# EAGLE design LPC218devboard (EAGLE 7.7.0)
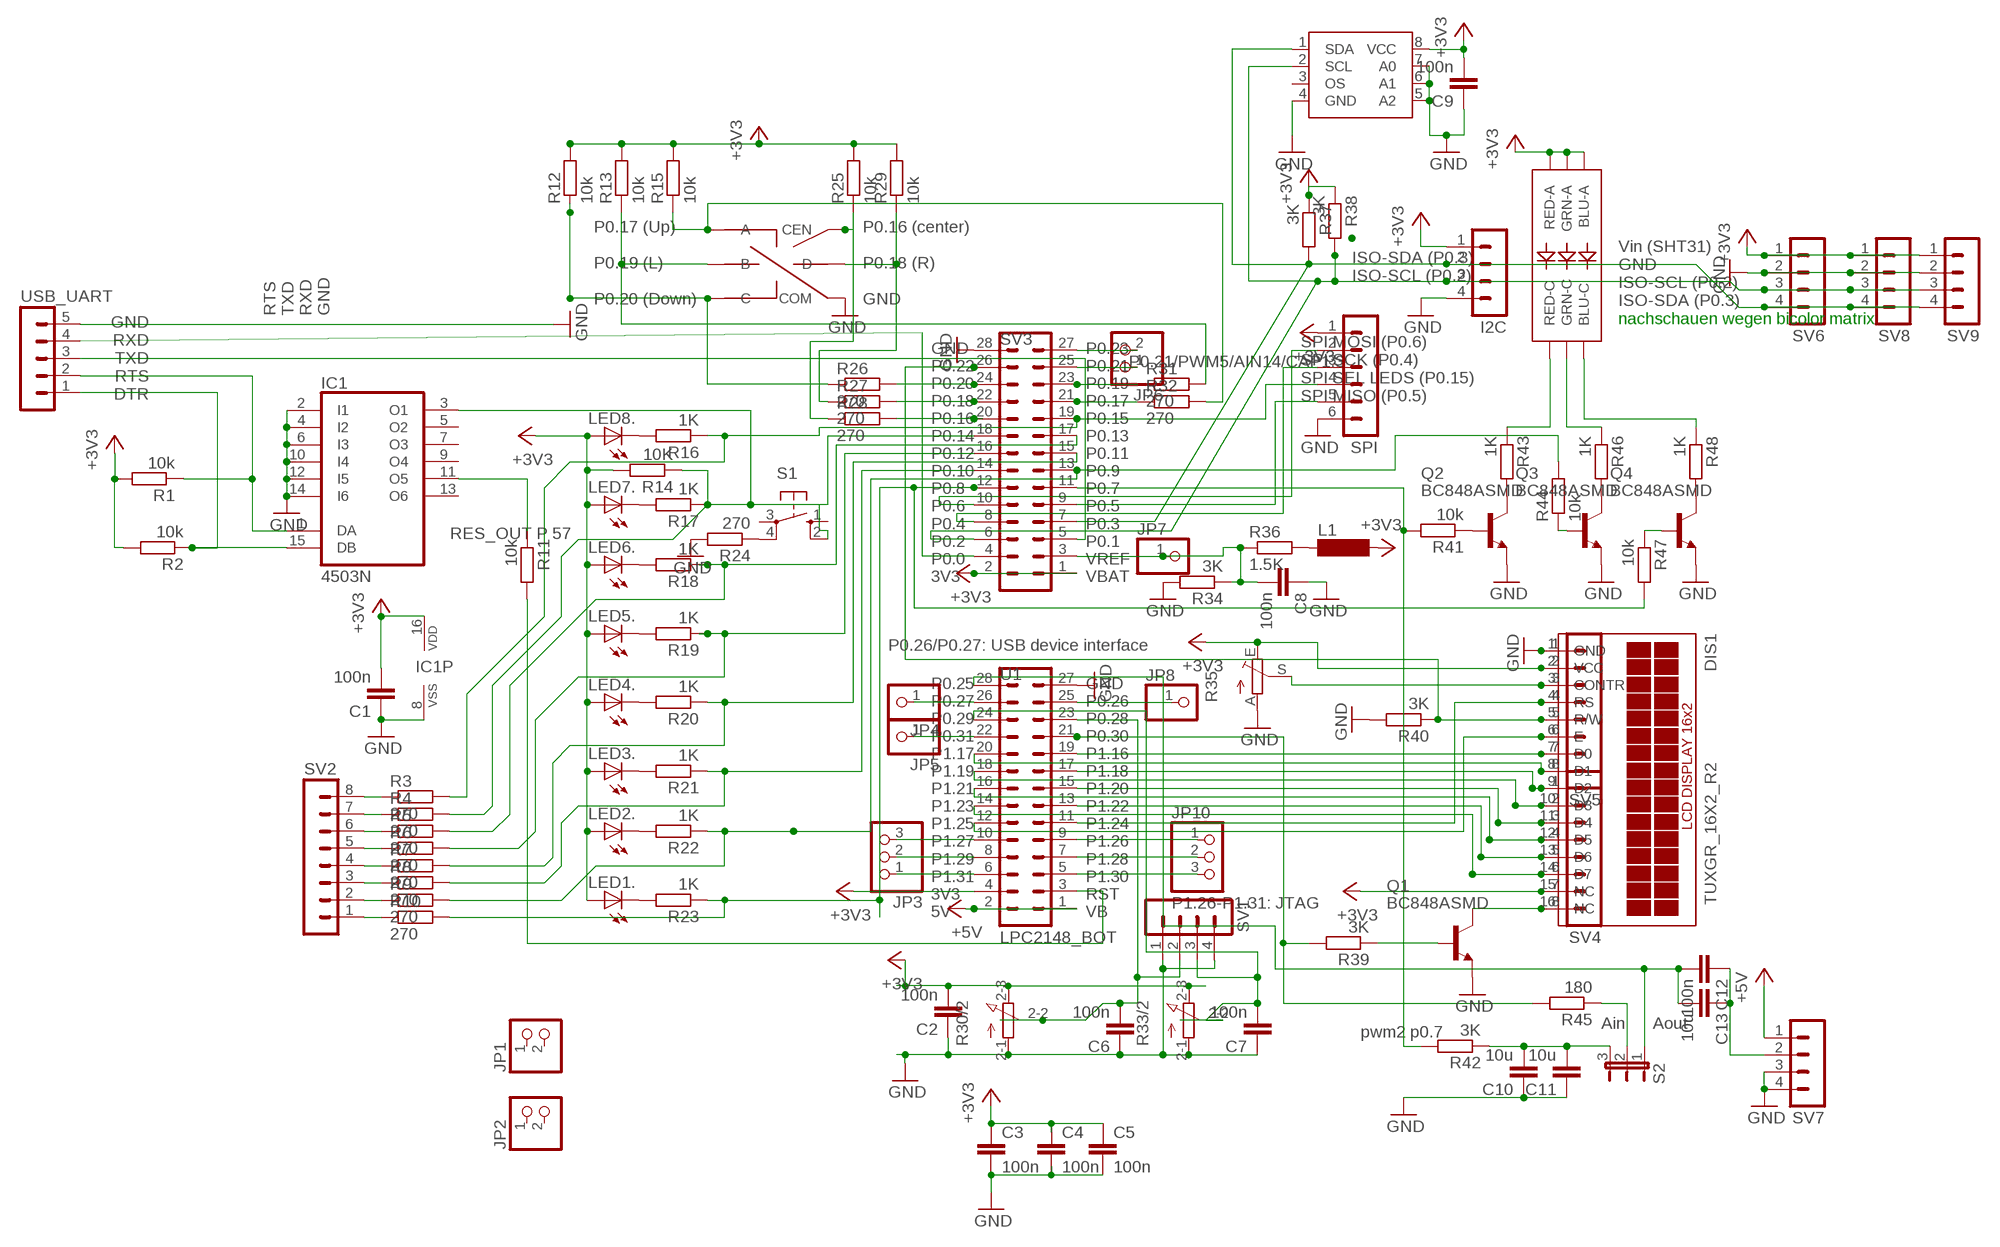
[diagram p0: schematic, sheet 1]

## Parts
C1  100n  C-EUC0805  [C0805]
C2  100n  C-EUC0805  [C0805]
C3  100n  C-EUC0805  [C0805]
C4  100n  C-EUC0805  [C0805]
C5  100n  C-EUC0805  [C0805]
C6  100n  C-EUC0805  [C0805]
C7  100n  C-EUC0805  [C0805]
C8  100n  C-EUC0805  [C0805]
C9  100n  C-EUC0805  [C0805]
C10  10u  C-EUC1206K  [C1206K]
C11  10u  C-EUC1206K  [C1206K]
C12  100n  C-EUC0805  [C0805]
C13  10u  C-EUC1206K  [C1206K]
D1  LED-RGBNO_IC  [LED-TRICOLOR-5050]
DIS1  TUXGR_16X2_R2  [TUXGR_16X2_R2]
I2C  MA04-1  [MA04-1]
IC1  4503N  [DIL16]
IC2  LM75A  [SO8]
JP1  PINHD-1X2  [1X02]
JP2  PINHD-1X2  [1X02]
JP3  PINHD-1X3  [1X03]
JP4  PINHD-1X1  [1X01]
JP5  PINHD-1X1  [1X01]
JP6  PINHD-1X2  [1X02]
JP7  PINHD-1X1  [1X01]
JP8  PINHD-1X1  [1X01]
JP10  PINHD-1X3  [1X03]
L1  MS50  [MS50]
LED1.  LED5MM  [LED5MM]
LED2.  LED5MM  [LED5MM]
LED3.  LED5MM  [LED5MM]
LED4.  LED5MM  [LED5MM]
LED5.  LED5MM  [LED5MM]
LED6.  LED5MM  [LED5MM]
LED7.  LED5MM  [LED5MM]
LED8.  LED5MM  [LED5MM]
Q1  BC848ASMD  [SOT23]
Q2  BC848ASMD  [SOT23]
Q3  BC848ASMD  [SOT23]
Q4  BC848ASMD  [SOT23]
R1  10k  R-EU_0207/12  [0207/12]
R2  10k  R-EU_0207/12  [0207/12]
R3  270  R-EU_R0805  [R0805]
R4  270  R-EU_R0805  [R0805]
R5  270  R-EU_R0805  [R0805]
R6  270  R-EU_R0805  [R0805]
R7  270  R-EU_R0805  [R0805]
R8  270  R-EU_R0805  [R0805]
R9  270  R-EU_R0805  [R0805]
R10  270  R-EU_R0805  [R0805]
R11  10k  R-EU_0207/12  [0207/12]
R12  10k  R-EU_0207/12  [0207/12]
R13  10k  R-EU_0207/12  [0207/12]
R14  10K  R-EU_0207/12  [0207/12]
R15  10k  R-EU_0207/12  [0207/12]
R16  1K  R-EU_0204/7  [0204/7]
R17  1K  R-EU_0204/7  [0204/7]
R18  1K  R-EU_0207/10  [0207/10]
R19  1K  R-EU_0207/12  [0207/12]
R20  1K  R-EU_0207/10  [0207/10]
R21  1K  R-EU_0207/12  [0207/12]
R22  1K  R-EU_0207/12  [0207/12]
R23  1K  R-EU_0207/15  [0207/15]
R24  270  R-EU_0207/12  [0207/12]
R25  10k  R-EU_0207/12  [0207/12]
R26  270  R-EU_0207/12  [0207/12]
R27  270  R-EU_0207/12  [0207/12]
R28  270  R-EU_0207/12  [0207/12]
R29  10k  R-EU_0207/12  [0207/12]
R30  DUAL_15MM_SHAFT  [RK097G]
R31  270  R-EU_0207/12  [0207/12]
R32  270  R-EU_0207/12  [0207/12]
R33  DUAL_15MM_SHAFT  [RK097G]
R34  3K  R-EU_0207/12  [0207/12]
R35  TRIM_EU-S63P  [S63P]
R36  1.5K  R-EU_0207/10  [0207/10]
R37  3K  R-EU_R0805  [R0805]
R38  3K  R-EU_R0805  [R0805]
R39  3K  R-EU_R0805  [R0805]
R40  3K  R-EU_R0805  [R0805]
R41  10k  R-EU_0207/12  [0207/12]
R42  3K  R-EU_0207/12  [0207/12]
R43  1K  R-EU_R0805  [R0805]
R44  10k  R-EU_0207/12  [0207/12]
R45  180  R-EU_0817/22  [P0817/22]
R46  1K  R-EU_R0805  [R0805]
R47  10k  R-EU_0207/12  [0207/12]
R48  1K  R-EU_R0805  [R0805]
S1  40-XX  [B3F-40XX]
S2  JP2E_ORIGJP2_ORIG  [JP2_ORIG]
SPI  MA06-1  [MA06-1]
SV1  MA04-1  [MA04-1]
SV2  MA08-1  [MA08-1]
SV3  LPC2148_TOP  [ML26]
SV4  MA08-1  [MA08-1]
SV5  MA08-1  [MA08-1]
SV6  MA04-1  [MA04-1]
SV7  MA04-1  [MA04-1]
SV8  MA04-1  [MA04-1]
SV9  MA04-1  [MA04-1]
SW1  ALPS_SKQ_MDSPTH  [ALPS_SKQ_MDS_PTH]
U1  LPC2148_BOT  [ML26]
USB_UART  MA05-1  [MA05-1]

## Nets
+3V3: C1.2 C2.2 C3.1 C4.1 C5.1 C9.2 D1.1(GRN-A) D1.2(RED-A) D1.3(BLU-A) DIS1.2(VCC) DIS1.15(NC) I2C.1 IC1.16(VDD) IC2.8(VCC) L1.2 LED1..A LED2..A LED3..A LED4..A LED5..A LED6..A LED7..A LED8..A R1.2 R2.2 R12.2 R13.2 R14.2 R15.2 R25.2 R29.2 R30.2-3(/2:E) R33.2-3(/2:E) R35.E R37.1 R38.1 SPI.1 SV3.1 SV3.2 SV4.7 SV5.2 SV6.1 SV8.1 SV9.1 U1.4
+5V: SV7.1 U1.1 U1.2
GND: C1.1 C2.1 C3.2 C4.2 C5.2 C6.1 C7.1 C8.1 C9.1 C10.1 C11.1 DIS1.1(GND) I2C.4 IC1.2(I1) IC1.4(I2) IC1.6(I3) IC1.8(VSS) IC1.10(I4) IC1.12(I5) IC1.14(I6) IC2.4(GND) IC2.5(A2) IC2.6(A1) IC2.7(A0) Q1.2(E) Q2.2(E) Q3.2(E) Q4.2(E) R24.2 R30.2-1(/2:A) R33.2-1(/2:A) R34.2 R35.A R40.2 SPI.6 SV1.1 SV1.4 SV3.28 SV5.1 SV6.2 SV7.3 SV7.4 SV8.2 SV9.2 SW1.4(COM) U1.27 USB_UART.5
N$1: IC1.1(DA) R1.1 USB_UART.2
N$2: DIS1.7(D0) SV5.7 U1.19
N$3: DIS1.8(D1) SV5.8 U1.20
N$4: DIS1.9(D2) SV4.1 U1.17
N$5: DIS1.10(D3) SV4.2 U1.18
N$6: DIS1.11(D4) SV4.3 U1.15
N$7: DIS1.12(D5) SV4.4 U1.16
N$8: DIS1.13(D6) SV4.5 U1.13
N$10: R11.2 U1.3
N$12: DIS1.5(R/W) R40.1 SV3.26 SV5.5
N$13: DIS1.6(E) SV5.6 U1.12
N$14: R39.2 R45.2 U1.21
N$15: Q1.1(B) R39.1
N$16: DIS1.16(NC) Q1.3(C) SV4.8
N$17: DIS1.3(CONTR) R35.S SV5.3
N$18: R26.2 SV3.24
N$19: R27.2 SV3.22
N$20: R28.2 SV3.20
N$21: R32.1 SV3.21
N$22: R31.1 SV3.23
N$23: R25.1 R28.1 SW1.6(CEN)
N$24: R27.1 R29.1 SW1.5(D)
N$25: R15.1 R32.2 SW1.1(A)
N$26: R13.1 R31.2 SW1.2(B)
N$27: R12.1 R26.1 SW1.3(C)
N$28: LED1..K(C) R23.2
N$29: LED2..K(C) R22.2
N$30: R24.1 S1.4(P1)
N$31: LED7..K(C) R17.2
N$32: R3.1 SV2.8
N$33: R4.1 SV2.7
N$34: Q4.3(C) R48.2
N$35: LED3..K(C) R21.2
N$36: LED4..K(C) R20.2
N$37: R5.1 SV2.6
N$38: R6.1 SV2.5
N$39: R7.1 SV2.4
N$41: Q3.3(C) R46.2
N$42: LED5..K(C) R19.2
N$43: LED6..K(C) R18.2
N$44: R8.1 SV2.3
N$45: R9.1 SV2.2
N$46: R10.1 SV2.1
N$48: Q2.3(C) R43.2
N$50: LED8..K(C) R16.2
N$52: L1.1 R36.2
N$55: Q2.1(B) R41.1
N$56: D1.5(RED-C) R43.1
N$57: D1.6(GRN-C) R46.1
N$58: D1.4(BLU-C) R48.1
N$59: R41.2 R42.2 SV3.11
N$60: Q4.1(B) R47.1
N$61: Q3.1(B) R44.1
N$62: SV3.4 USB_UART.4
N$63: SV3.5 USB_UART.3
N$66: C6.2 R30.2-2(/2:S) SV1.2 U1.23
N$67: R45.1 S2.2
N$68: C7.2 R33.2-2(/2:S) SV1.3 U1.24
N$69: C12.1 C13.1 SV7.2
N$70: C10.2 C11.2 R42.1 S2.3
N$71: IC1.11(O5) R11.1
N$72: C12.2 C13.2 S2.1 U1.28
N$73: IC1.15(DB) R2.1 USB_UART.1
N$74: C8.2 JP7.1 R34.1 R36.1 SV3.3
N$75: JP10.1 U1.9
N$76: JP10.2 U1.7
N$77: JP10.3 U1.5
N$78: JP3.3 U1.10
N$79: JP3.2 U1.8
N$80: JP3.1 U1.6
N$81: JP4.1 U1.26
N$82: JP5.1 U1.22
N$83: JP8.1 U1.25
P0.8: R10.2 R23.1 R47.2 SV3.12
P0.9: R9.2 R22.1 R44.2 SV3.13
P0.10: R8.2 R21.1 SV3.14
P0.11: R7.2 R20.1 SV3.15
P0.12: R6.2 R19.1 SV3.16
P0.13: R5.2 R18.1 SV3.17
P0.14: IC1.3(O1) R4.2 R14.1 R17.1 S1.2(S1) SV3.18
P0.21: JP6.1 SV3.25
P0.23: JP6.2 SV3.27
P1.23: DIS1.14(D7) SV4.6 U1.14
P1.24: DIS1.4(RS) SV5.4 U1.11
SCL: I2C.3 IC2.2(SCL) R38.2 SV3.6 SV6.3 SV8.3 SV9.3
SDA: I2C.2 IC2.1(SDA) R37.2 SV3.7 SV6.4 SV8.4 SV9.4
SPI_MISO: SPI.5 SV3.9
SPI_MOSI: SPI.2 SV3.10
SPI_SCK: SPI.3 SV3.8
SPI_SEL: R3.2 R16.1 SPI.4 SV3.19
Unconnected: IC1.5(O2) IC1.7(O3) IC1.9(O4) IC1.13(O6) IC2.3(OS) JP1.1 JP1.2 JP2.1 JP2.2 R30.1-1(/1:A) R30.1-2(/1:S) R30.1-3(/1:E) R33.1-1(/1:A) R33.1-2(/1:S) R33.1-3(/1:E) S1.1(S) S1.3(P)

## Notes on the sheet
- ISO-SDA (P0.3)
  ISO-SCL (P0.2)
- GND
  RXD
  TXD
  RTS
  DTR
- RTS
  TXD
  RXD
  GND
- Vin (SHT31)
  GND
  ISO-SCL (P0.2)
  ISO-SDA (P0.3)
- nachschauen wegen bicolor matrix
- P0.21/PWM5/AIN14/CAP1.3
- SPI MOSI (P0.6)
  SPI SCK (P0.4)
  SPI SEL LEDS (P0.15)
  SPI MISO (P0.5)
- RES_OUT P 57
- P0.26/P0.27: USB device interface
- P1.26-P1.31: JTAG
- Ain | Aout
- pwm2 p0.7

## Library data of the parts
C1-C13 = rcl:C-EU: CAPACITOR, European symbol
D1 = LED-RGB:LED-RGB; PROD_ID: DIO-10298
DIS1 = display-lcd:TUXGR_16X2_R2: Tuxgraphics LCD display 16x2 characters reflective, without background light Source: tuxgr_12x2_r2.pdf; OC_FARNELL: unknown; OC_NEWARK: unknown
I2C SV1 SV6-SV9 = con-lstb:MA04-1: PIN HEADER; OC_FARNELL: unknown; OC_NEWARK: unknown
IC1 = 45xx:4503: Tri-state hex BUFFER, 74C367, 80C97
IC2 = LM75A:LM75A
JP1 JP2 JP6 = pinhead:PINHD-1X2: PIN HEADER
JP3 JP10 = pinhead:PINHD-1X3: PIN HEADER
JP4 JP5 JP7 JP8 = pinhead:PINHD-1X1: PIN HEADER
L1 = inductor-neosid:MS50: INDUCTOR SMD power inductor; OC_FARNELL: unknown; OC_NEWARK: unknown
LED1. LED2. LED3. LED4. LED5. LED6. LED7. LED8. = led:LED: LED OSRAM: - CHIPLED LG R971, LG N971, LY N971, LG Q971, LY Q971, LO R971, LY R971 LH N974, LH R974 LS Q976, LO Q976, LY Q976 LO Q996 - Hyper CHIPLED LW Q18S LB Q993, LB Q99A, LB R99A - SideLED LS A670, LO A670, LY A670, LG A670, LP A670 LB A673, LV A673, LT A673, LW A673 LH A674 LY A675 LS A676, LA A676, LO A676, LY A676, LW A676 LS A679, LY A679, LG A679 - Hyper Micro SIDELED® LS Y876, LA Y876, LO Y876, LY Y876 LT Y87S - SmartLED LW L88C, LW L88S LB L89C, LB L89S, LG L890 LS L89K, LO L89K, LY L89K LS L896, LA L896, LO L896, LY L896 - TOPLED LS T670, LO T670, LY T670, LG T670, LP T670 LSG T670, LSP T670, LSY T670, LOP T670, LYG T670 LG T671, LOG T671, LSG T671 LB T673, LV T673, LT T673, LW T673 LH T674 LS T676, LA T676, LO T676, LY T676, LB T676, LH T676, LSB T676, LW T676 LB T67C, LV T67C, LT T67C, LS T67K, LO T67K, LY T67K, LW E67C LS E67B, LA E67B, LO E67B, LY E67B, LB E67C, LV E67C, LT E67C LW T67C LS T679, LY T679, LG T679 LS T770, LO T770, LY T770, LG T770, LP T770 LB T773, LV T773, LT T773, LW T773 LH T774 LS E675, LA E675, LY E675, LS T675 LS T776, LA T776, LO T776, LY T776, LB T776 LHGB T686 LT T68C, LB T68C - Hyper Mini TOPLED® LB M676 - Mini TOPLED Santana® LG M470 LS M47K, LO M47K, LY M47K Source: http://www.osram.convergy.de LUXEON: - LUMILED® LXK2-PW12-R00, LXK2-PW12-S00, LXK2-PW14-U00, LXK2-PW14-V00 LXK2-PM12-R00, LXK2-PM12-S00, LXK2-PM14-U00 LXK2-PE12-Q00, LXK2-PE12-R00, LXK2-PE12-S00, LXK2-PE14-T00, LXK2-PE14-U00 LXK2-PB12-K00, LXK2-PB12-L00, LXK2-PB12-M00, LXK2-PB14-N00, LXK2-PB14-P00, LXK2-PB14-Q00 LXK2-PR12-L00, LXK2-PR12-M00, LXK2-PR14-Q00, LXK2-PR14-R00 LXK2-PD12-Q00, LXK2-PD12-R00, LXK2-PD12-S00 LXK2-PH12-R00, LXK2-PH12-S00 LXK2-PL12-P00, LXK2-PL12-Q00, LXK2-PL12-R00 Source: www.luxeon.com KINGBRIGHT: KA-3528ASYC Source: www.kingbright.com
Q1-Q4 = transistor-npn:BC848*: NPN Transistor
R1-R29 R31 R32 R34 R36-R48 = rcl:R-EU_: RESISTOR, European symbol
R30 R33 = poti_RK097G:DUAL_15MM_SHAFT: 16mm Potentiometer two level Source: http://www.alphapotentiometers.net/html/16mm_pot_2.html
R35 = pot:TRIM_EU-: POTENTIOMETER
S1 = switch-omron:40-XX: OMRON SWITCH; MF: OMRON COMPONENTS USA; MPN: B3F-4000; OC_FARNELL: 176434; OC_NEWARK: 36K3105
S2 = Switch Aliexpress 2:JP2E_ORIG
SPI = con-lstb:MA06-1: PIN HEADER; OC_FARNELL: unknown; OC_NEWARK: unknown
SV2 SV4 SV5 = con-lstb:MA08-1: PIN HEADER; OC_FARNELL: unknown; OC_NEWARK: unknown
SV3 = con_LPC2148:LPC2148_TOP: LPC2148 dev board
SW1 = ALPS_SKQ_MDS:ALPS_SKQ_MDS
U1 = con_LPC2148:LPC2148_BOT: LPC2148 dev board
USB_UART = con-lstb:MA05-1: PIN HEADER; OC_FARNELL: unknown; OC_NEWARK: unknown

## Board
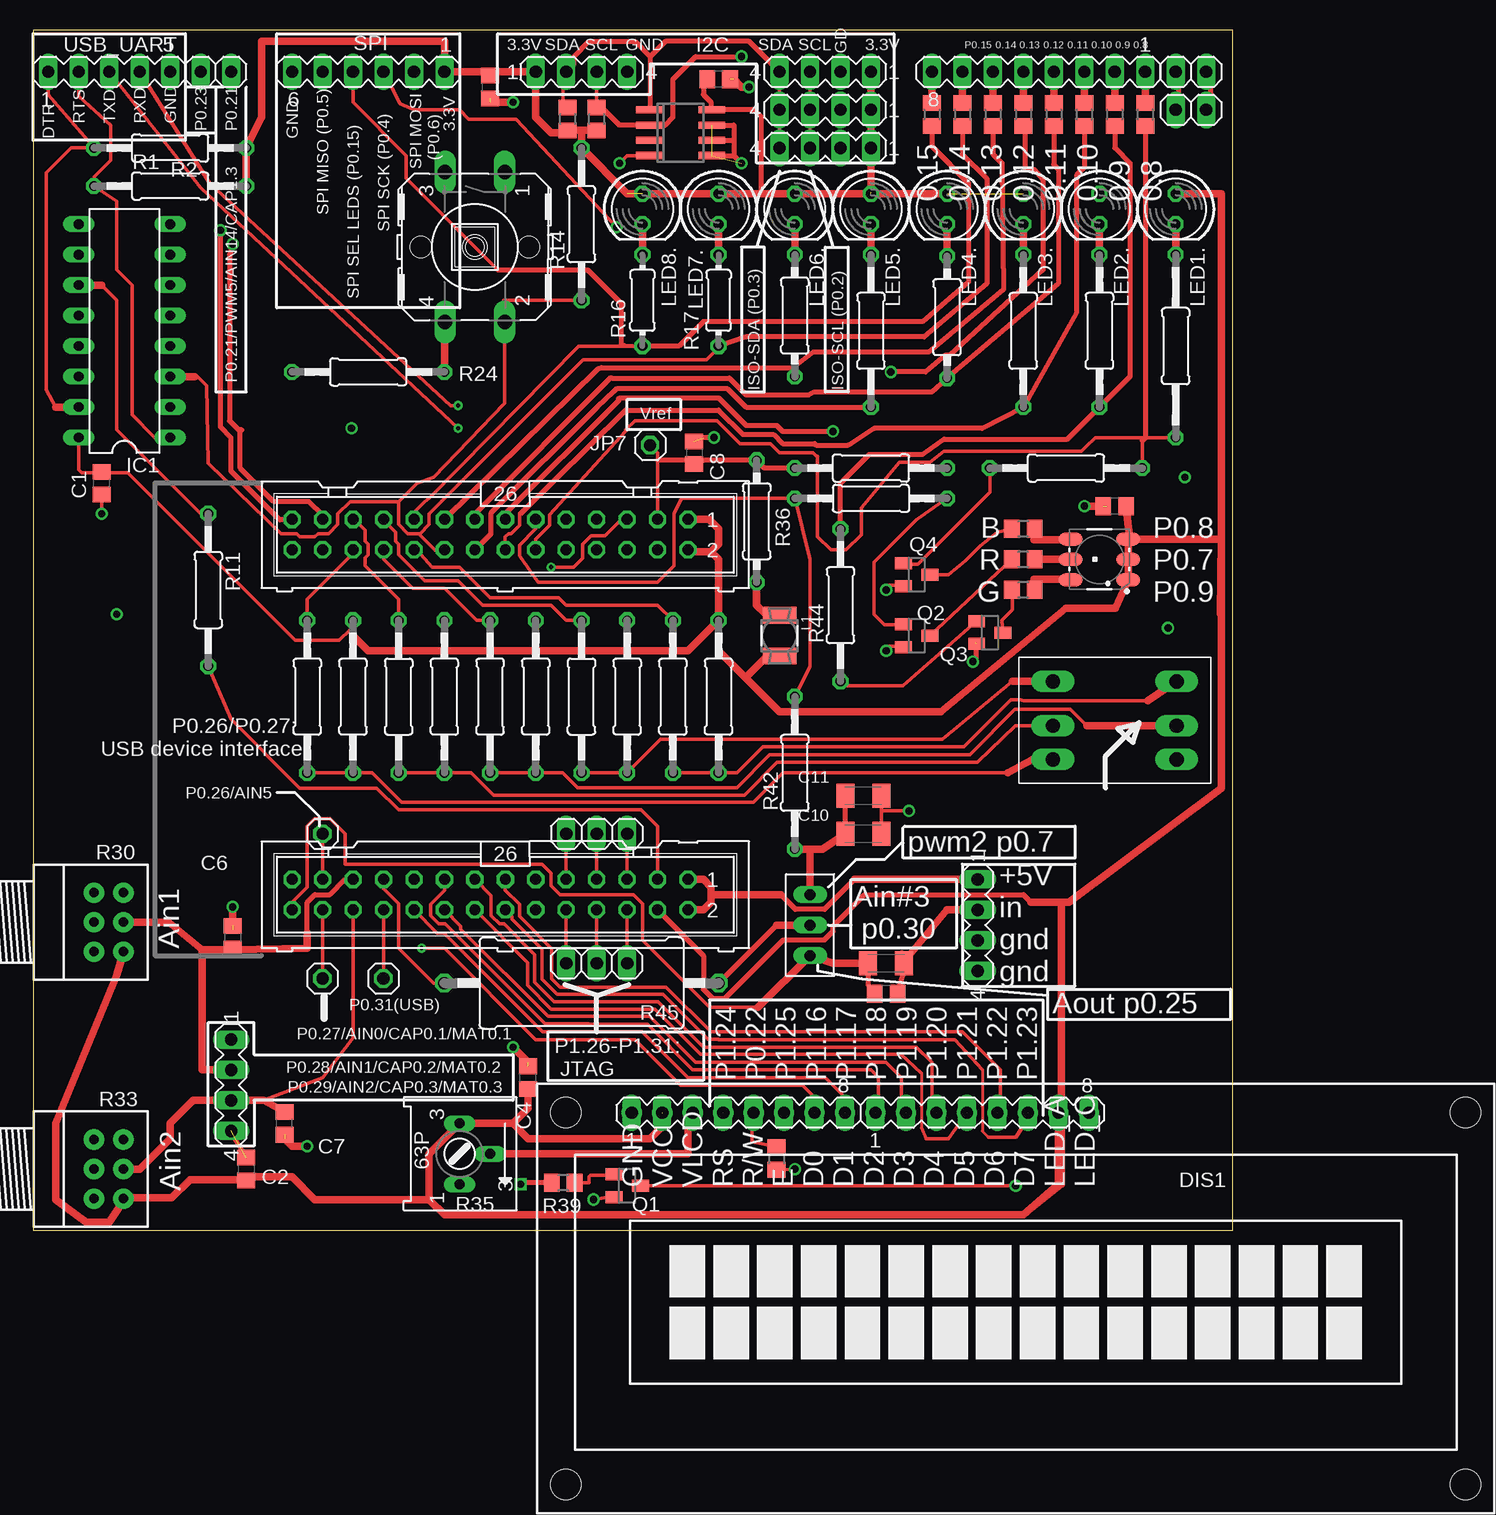
[diagram p1: board, top side]
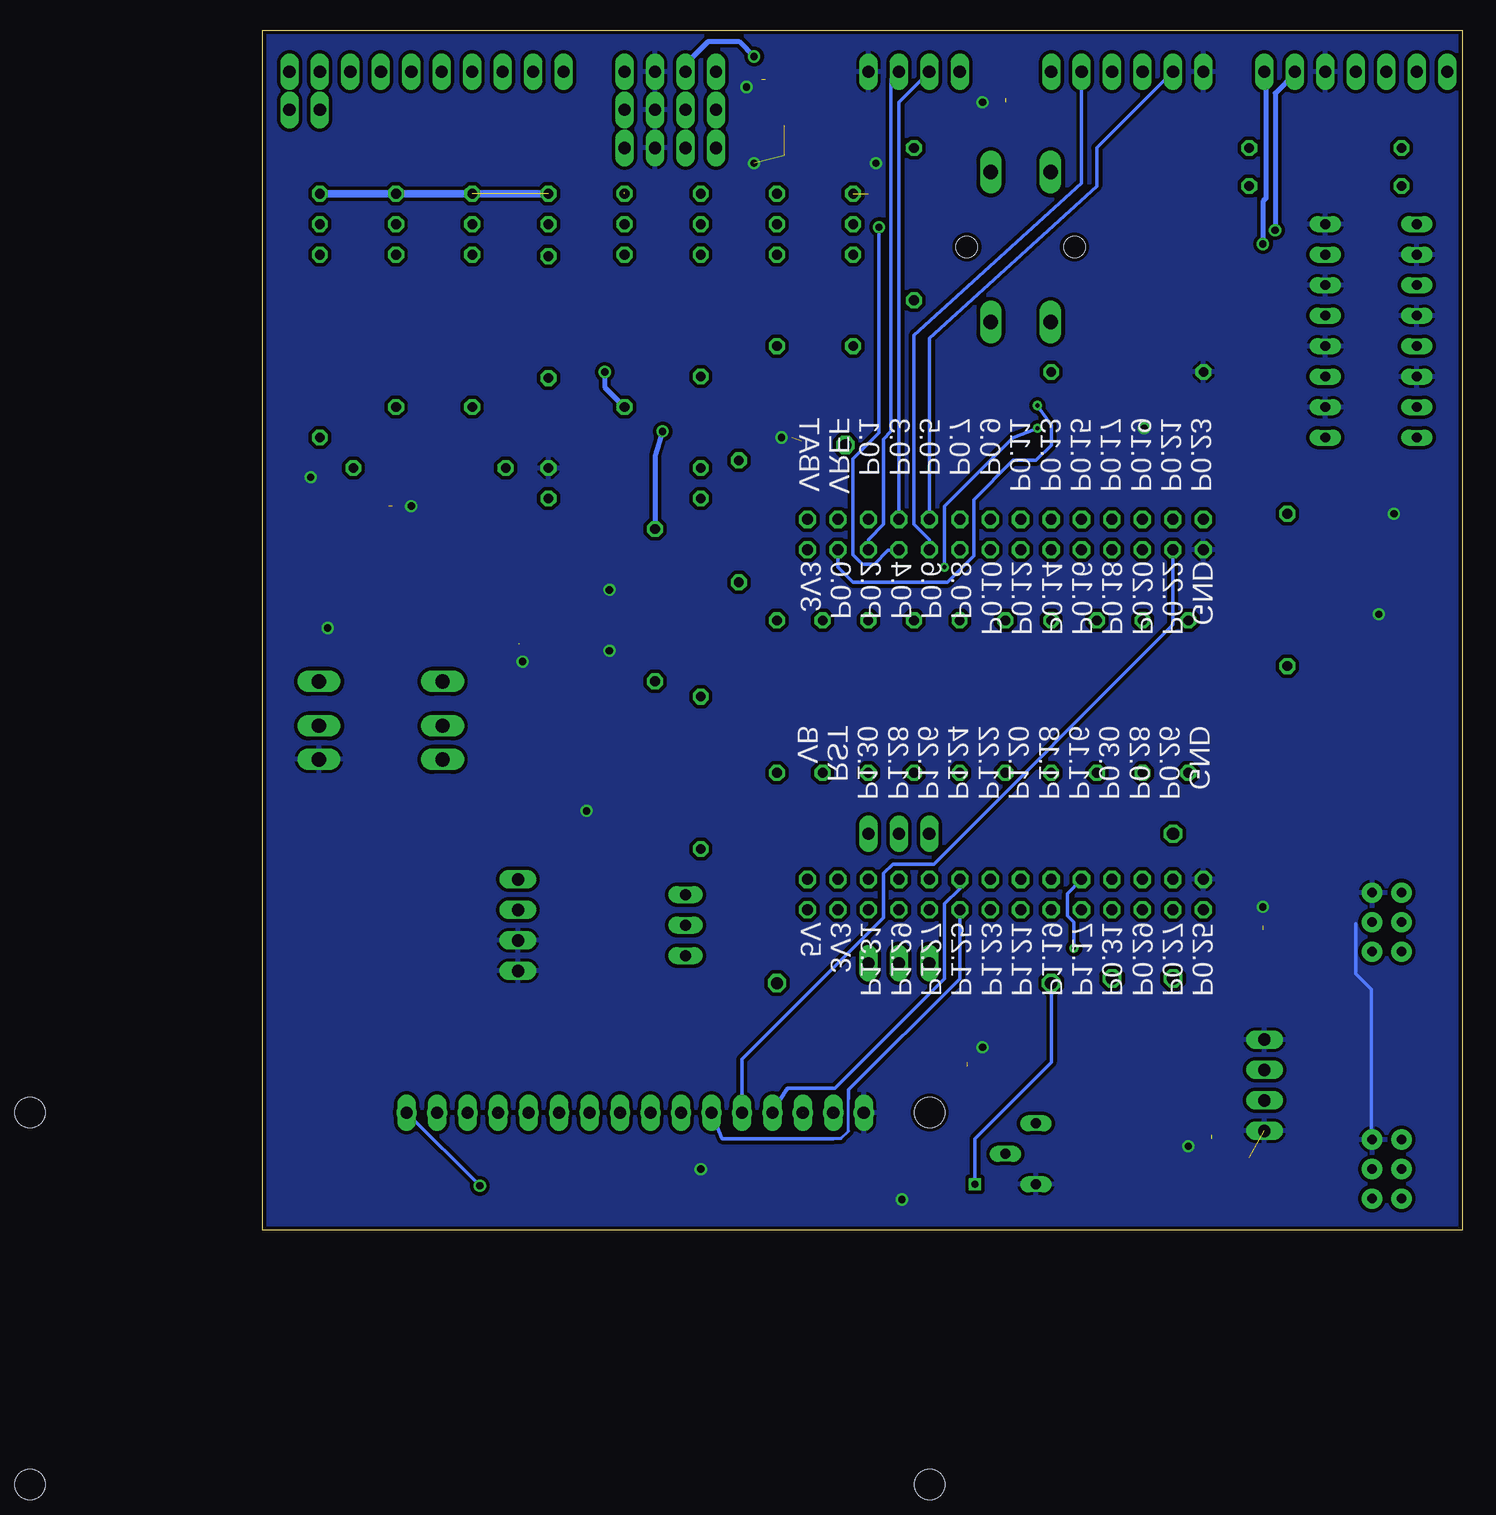
[diagram p2: board, bottom side, seen from below]

Size 100 x 100 mm. Coordinates in mm from the lower left corner, seen from the top.
Outline: 0,0 100,0 100,100 0,100 0,0
Copper layers (1*16): Top 0.035mm / dielectric 1.5mm / Bottom 0.035mm
Design rules "default *": minimum track width 12mil, minimum drill 24mil, track to track 12mil, track to pad 12mil, pad to pad 0.5mm, via to via 0.5mm, smd to smd 8mil, copper to edge 12mil, drill to drill 8mil, minimum pad ring 10mil, minimum via ring 8mil, stop-mask expansion 4mil, vias tented up to drill 0mil, thermal gap 10mil

### Footprints (pad centres in the part's own frame; a part is rotated, then mirrored left to right if it is on the bottom)
C0805 = smd 1.3 x 1.5: 1 -0.95,0; 2 0.95,0
C1206K = smd 1.5 x 2: 1 -1.5,0; 2 1.5,0
LED-TRICOLOR-5050 = smd 2 x 1.1: 1 -2.4,1.7; 2 -2.4,0; 3 -2.4,-1.7; 4 2.4,-1.7; 5 2.4,0; 6 2.4,1.7
TUXGR_16X2_R2 = drill 1 pad 1.676: 1 -32,15.5; 2 -29.46,15.5; 3 -26.92,15.5; 4 -24.38,15.5; 5 -21.84,15.5; 6 -19.3,15.5; 7 -16.76,15.5; 8 -14.22,15.5; 9 -11.68,15.5; 10 -9.14,15.5; 11 -6.6,15.5; 12 -4.06,15.5; 13 -1.52,15.5; 14 1.02,15.5; 15 3.56,15.5; 16 6.1,15.5 | hole 2.5: -37.5,-15.5; 37.5,-15.5; -37.5,15.5; 37.5,15.5
MA04-1 = drill 1.016 long: 1 -3.81,0; 2 -1.27,0; 3 1.27,0; 4 3.81,0
DIL16 = drill 0.813 long: 1 -8.89,-3.81; 2 -6.35,-3.81; 3 -3.81,-3.81; 4 -1.27,-3.81; 5 1.27,-3.81; 6 3.81,-3.81; 7 6.35,-3.81; 8 8.89,-3.81; 9 8.89,3.81; 10 6.35,3.81; 11 3.81,3.81; 12 1.27,3.81; 13 -1.27,3.81; 14 -3.81,3.81; 15 -6.35,3.81; 16 -8.89,3.81
SO8 = smd 0.6 x 2.2: 1 -1.905,-2.6; 2 -0.635,-2.6; 3 0.635,-2.6; 4 1.905,-2.6; 5 1.905,2.6; 6 0.635,2.6; 7 -0.635,2.6; 8 -1.905,2.6
1X02 = drill 1.016 long: 1 -1.27,0; 2 1.27,0
1X03 = drill 1.016 long: 1 -2.54,0; 2 0,0; 3 2.54,0
1X01 = drill 1.016 octagon: 1 0,0
MS50 = smd 2.8 x 1.4: 1 0,-1.7; 2 0,1.7
LED5MM = drill 0.813 octagon: A -1.27,0; K 1.27,0
SOT23 = smd 1 x 1.4: 1 -0.95,-1.1; 2 0.95,-1.1; 3 0,1.1
0207/12 = drill 0.813 octagon: 1 -6.35,0; 2 6.35,0
R0805 = smd 1.3 x 1.5: 1 -0.95,0; 2 0.95,0
0204/7 = drill 0.813 octagon: 1 -3.81,0; 2 3.81,0
0207/10 = drill 0.813 octagon: 1 -5.08,0; 2 5.08,0
0207/15 = drill 0.813 octagon: 1 -7.62,0; 2 7.62,0
RK097G = drill 0.8 pad 1.676: 1-1 -2.46,-1.27; 1-2 0,-1.27; 1-3 2.46,-1.27; 2-1 -2.46,1.19; 2-2 0,1.19; 2-3 2.46,1.19
S63P = drill 0.813 long: A 2.54,0; E -2.54,0; S 0,2.54
P0817/22 = drill 1.016 octagon: 1 -11.43,0; 2 11.43,0
B3F-40XX = drill 1.194 long: 1 -6.248,2.489; 2 6.248,2.489; 3 -6.248,-2.489; 4 6.248,-2.489 | hole 1.803: 0,-4.496; 0,4.496
JP2_ORIG = drill 0.914 long: 1 -2.54,0; 2 0,0; 3 2.54,0
MA06-1 = drill 1.016 long: 1 -6.35,0; 2 -3.81,0; 3 -1.27,0; 4 1.27,0; 5 3.81,0; 6 6.35,0
MA08-1 = drill 1.016 long: 1 -8.89,0; 2 -6.35,0; 3 -3.81,0; 4 -1.27,0; 5 1.27,0; 6 3.81,0; 7 6.35,0; 8 8.89,0
ML26 = drill 0.914 octagon: 1 -15.24,-1.27; 2 -15.24,1.27; 3 -12.7,-1.27; 4 -12.7,1.27; 5 -10.16,-1.27; 6 -10.16,1.27; 7 -7.62,-1.27; 8 -7.62,1.27; 9 -5.08,-1.27; 10 -5.08,1.27; 11 -2.54,-1.27; 12 -2.54,1.27; 13 0,-1.27; 14 0,1.27; 15 2.54,-1.27; 16 2.54,1.27; 17 5.08,-1.27; 18 5.08,1.27; 19 7.62,-1.27; 20 7.62,1.27; 21 10.16,-1.27; 22 10.16,1.27; 23 12.7,-1.27; 24 12.7,1.27; 25 15.24,-1.27; 26 15.24,1.27; 27 17.78,-1.27; 28 17.78,1.27
ALPS_SKQ_MDS_PTH = drill 1.2 long: 1 -5.15,2.54; 2 -5.15,-1.16; 3 -5.15,-3.96; 4 5.15,-3.96; 5 5.15,-1.16; 6 5.15,2.54
MA05-1 = drill 1.016 long: 1 -5.08,0; 2 -2.54,0; 3 0,0; 4 2.54,0; 5 5.08,0

### Placement (x,y rotation side)
C1  5.71,62.23 90 top
C2  17.78,5.08 270 top
C3  38.1,95.25 270 top
C4  41.27,12.7 90 top
C5  90.17,60.33 180 top
C6  16.64,24.38 270 top
C7  20.95,8.89 90 top
C8  55.12,64.77 270 top
C9  57.15,95.89 180 top
C10  69.22,33.02 180 top
C11  69.22,36.2 180 top
C12  71.12,19.68 180 top
C13  71.12,22.23 180 top
D1  88.9,55.88 180 top
DIS1  81.92,-5.71 0 top
I2C  45.72,96.52 0 top
IC1  7.62,74.93 90 top
IC2  53.98,91.44 270 top
JP1  96.52,96.52 0 top
JP2  96.52,93.34 0 top
JP3  46.99,22.23 180 top
JP4  24.13,20.95 0 top
JP5  29.21,20.95 0 top
JP6  15.24,96.52 180 top
JP7  51.44,65.41 0 top
JP8  24.13,33.02 0 top
JP10  46.99,33.02 0 top
L1  62.23,49.53 180 top
LED1.  95.25,85.09 270 top
LED2.  88.9,85.09 270 top
LED3.  82.55,85.09 270 top
LED4.  76.2,85.09 270 top
LED5.  69.85,85.09 270 top
LED6.  63.5,85.09 270 top
LED7.  57.15,85.09 270 top
LED8.  50.8,85.09 270 top
Q1  49.53,3.68 270 top
Q2  73.66,49.53 270 top
Q3  79.76,49.78 270 top
Q4  73.66,54.61 270 top
R1  11.43,87 0 top
R2  11.43,90.17 0 top
R3  74.93,92.96 270 top
R4  77.47,92.96 270 top
R5  80.01,92.96 270 top
R6  82.55,92.96 270 top
R7  85.09,92.96 270 top
R8  87.63,92.96 270 top
R9  90.17,92.96 270 top
R10  92.71,92.96 270 top
R11  14.61,53.34 270 top
R12  26.67,44.45 90 top
R13  34.29,44.45 90 top
R14  45.72,83.82 90 top
R15  49.53,44.45 90 top
R16  50.8,77.47 90 top
R17  57.15,77.47 90 top
R18  63.5,76.2 90 top
R19  69.85,74.93 90 top
R20  76.2,76.07 90 top
R21  82.55,74.93 90 top
R22  88.9,74.93 90 top
R23  95.25,73.66 90 top
R24  27.94,71.5 180 top
R25  57.15,44.45 90 top
R26  22.86,44.45 90 top
R27  38.1,44.45 90 top
R28  53.34,44.45 90 top
R29  41.91,44.45 90 top
R30  6.35,25.65 270 top
R31  30.48,44.45 270 top
R32  45.72,44.45 270 top
R33  6.35,5.08 270 top
R34  69.85,63.5 0 top
R35  35.56,6.35 270 top
R36  60.33,59.05 270 top
R37  44.58,92.58 90 top
R38  46.99,92.58 90 top
R39  44.2,3.94 180 top
R40  61.98,5.97 270 top
R41  69.85,60.96 180 top
R42  63.5,38.1 90 top
R43  82.55,55.88 180 top
R44  67.31,52.07 90 top
R45  45.72,20.57 180 top
R46  82.55,53.34 180 top
R47  86.11,63.5 0 top
R48  82.55,58.42 180 top
S1  36.83,81.92 270 top
S2  64.77,25.4 90 top
SPI  27.94,96.52 180 top
SV1  16.51,12.06 270 top
SV2  83.82,96.52 180 top
SV3  39.37,57.94 180 top
SV4  79.12,9.78 0 top
SV5  58.8,9.78 0 top
SV6  66.04,96.52 180 top
SV7  78.74,25.4 270 top
SV8  66.04,93.34 180 top
SV9  66.04,90.17 180 top
SW1  90.17,43.18 0 top
U1  39.37,27.94 180 top
USB_UART  6.35,96.52 0 top

### Tracks (layer width: path | path; a pad name or v marks a point on that pad's centre or on a via)
+3V3  (4 unrouted)
  Top 0.305: 56.52,93.34 56.26,93.34 | 91.31,55.88 D1.2 | 99.06,57.58 98.81,51.31 99.06,51.31 | SV4.7 | IC1.16 3.81,63.37 4.06,63.12 5.71,63.12 C1.2 5.84,63.12 7.87,63.12 21.84,49.15 25.53,49.15 26.42,50.04 26.67,50.04 | 45.85,91.63 45.85,91.69 45.72,91.44 | 17.78,4.19 C2.2 | 7.62,2.67 R33.2-3 7.49,2.67
  Top 0.406: 83.2,27.3 82.57,27.94 69.32,27.94 66.7,25.32 66.7,24.89 65.99,24.18 62.55,24.18 57.68,19.3 56.62,19.3 55.88,20.05 55.88,22.86 U1.4 | C9.2 55.88,95.25 55.88,94.61 56.52,93.98 56.52,93.34 IC2.8 60.07,93.34 60.71,92.71 60.71,86.36
  Top 0.61: R12.2 26.67,50.04 26.67,49.53 27.94,48.26 34.29,48.26 | 34.29,48.26 41.91,48.26 | 41.91,48.26 49.53,48.26 | 49.53,48.26 54.61,48.26 R25.2 | R15.2 49.53,48.26 | R29.2 41.91,48.26 | R13.2 34.29,48.26 | LED4..A LED6..A | LED6..A 60.71,86.36 LED7..A 49.53,86.36 R14.2 45.72,91.44 | R38.1 45.85,91.63 R37.1 44.38,91.44 43.18,91.44 41.91,92.71 I2C.1 38.1,96.52 | SV6.1 SV8.1 SV9.1 69.85,86.49 69.72,86.36 LED6..A | 91.44,57.58 D1.3 D1.2 D1.1 90.21,51.82 86.11,51.82 75.69,43.18 62.23,43.18 59.37,46.04 | 91.44,57.58 99.06,57.58 | 99.06,57.58 98.98,51.36 | LED1..A 99.06,86.36 99.06,57.58 | 99.06,57.58 99.06,51.31 99.06,36.83 86.36,27.3 85.72,27.3 | 85.72,27.3 85.72,3.81 82.55,1.27 | 82.55,1.27 85.47,3.81 SV4.7 | 82.55,1.27 34.29,1.27 33.02,2.54 | 33.02,2.54 33.02,6.35 R35.E 40.01,8.89 | SV3.1 56.36,59.21 57.15,58.42 57.15,57.15 56.52,56.52 | 56.52,56.52 54.77,56.52 SV3.2 | R25.2 57.15,55.88 56.52,56.52 | 38.1,96.52 SPI.1 34.29,99.06 19.05,99.06 19.05,92.71 R2.2 R1.2 | SV5.2 52.45,8.64 51.44,7.62 41.27,7.62 40.01,8.89 | 83.2,27.3 85.72,27.3 | R25.2 57.15,48.26 59.37,46.04 | 17.78,4.19 13.08,4.19 11.56,2.67 7.62,2.67 | 33.02,2.54 23.5,2.54 21.59,4.45 17.78,4.45 C2.2 | R33.2-3 7.62,2.54 6.35,0.64 4.45,0.64 1.91,2.54 1.91,8.89 6.99,21.21 R30.2-3 | L1.2 61.16,47.83 59.37,46.04 | C3.1 38.1,96.52 | C4.1 41.27,10.16 40.01,8.89 | C5.1 91.44,57.58
  Bottom 0.61: LED1..A LED2..A LED4..A
+5V
  Top 0.406: 68.47,29.21 65.99,26.72 63.55,26.72 62.34,27.94
  Top 0.61: U1.2 55.88,26.67 56.52,27.3 56.52,27.94 | 56.52,27.94 56.52,28.57 55.88,29.21 U1.1 | SV7.1 68.47,29.21 | 62.34,27.94 56.52,27.94
GND  (via drill 0.6)  (12 unrouted)
  Top 0.305: 70.74,34.92 70.74,33.66 C10.1 | 70.74,34.92 70.74,36.2 C11.1 | v46.74,2.54 48.26,2.79 48.77,2.79 Q1.2 | v71.12,48.26 71.12,48.51 71.25,48.64 72.52,48.64 Q2.2 | v71.12,53.34 71.12,53.59 71.25,53.72 72.52,53.72 Q4.2 | v63.5,5.08 R40.2 | v5.71,59.69 C1.1 | IC2.4 49.53,89.53 v48.9,88.9 | v73.03,34.92 70.74,34.92 | 17.78,5.97 C2.1
  Top 0.406: v56.77,66.04 55.88,66.04 | 78.61,48.9 78.61,47.62 v78.36,47.37
  Top 0.61: v59.69,95.25 59.05,95.25 58.42,95.89 | v40.01,93.98 38.1,93.98 | v40.01,15.24 41.27,13.97 | v87.63,60.33 89.53,60.33 | v16.64,26.92 16.64,25.02 | v22.86,6.99 21.59,6.99 20.95,7.62
  Bottom 0.305: 8.89,25.53 8.89,21.34 7.62,20.07 7.62,7.62 R33.2-1
  other vias: 59.05,88.9 26.54,66.8 6.99,51.31 94.61,50.16 96.01,62.74
  pour Bottom: -0.13,101.35 100.08,101.47 100.33,0 -0.64,-0.64
N$1
  Top 0.305: R1.1 5.59,87.12 | USB_UART.2 3.81,94.49 6.48,92.08 6.48,89.15 5.08,87.76 R1.1 | IC1.1 10.16,66.04 8.26,67.94 8.26,78.74 6.99,80.01 6.99,85.72 R1.1
N$2  (via drill 0.35)  (1 unrouted)
  Top 0.305: DIS1.7 65.16,11.04 64.14,12.06 53.98,12.06 50.16,15.88 41.91,15.88 34.29,23.5 v32.38,23.5
  Bottom 0.305: v32.38,23.5 32.38,25.65 32.92,26.19 32.92,28.04 U1.19
N$3  (1 unrouted)
  Top 0.305: SV5.8 67.69,11.04 66.04,12.7 54.61,12.7 50.77,16.54 42.47,16.54 34.27,24.74 33.68,24.74 U1.20
N$4  (1 unrouted)
  Top 0.305: U1.17 34.29,28.32 33.12,27.15 33.12,26.19 33.81,25.5 34.37,25.5 42.67,17.2 46.3,17.2 46.35,17.14 51.21,17.14 54.99,13.36 55.85,13.36 55.88,13.34 69.85,13.34 70.48,12.7 70.48,10.04 SV4.1
N$5  (1 unrouted)
  Top 0.305: U1.18 35.66,25.3 35.66,25.07 42.93,17.8 51.41,17.8 55.24,13.97 71.12,13.97 72.39,12.7 72.39,10.17 DIS1.10
N$6  (1 unrouted)
  Top 0.305: SV4.3 74.93,10.17 74.93,13.97 73.66,15.24 55.88,15.24 52.09,19.02 43.44,19.02 41.82,20.64 41.82,22.95 39.27,25.5 38.89,25.5 38.2,26.19 38.2,27.84 U1.15
N$7  (1 unrouted)
  Top 0.254: 74.04,13.08 74.04,10.44 74.05,10.31 74.05,8.51 74.42,7.62
  Top 0.305: U1.16 41.21,22.29 41.21,20.38 43.18,18.41 43.19,18.41 | 43.19,18.41 | 43.19,18.41 51.84,18.41 55.63,14.63 72.36,14.63 74.04,13.08 | 74.42,7.62 76.33,7.62 DIS1.12
N$8  (1 unrouted)
  Top 0.305: U1.13 39.37,28.32 40.54,27.15 40.54,26.14 43.23,23.44 43.23,20.96 43.95,20.24 52.78,20.24 56.52,16.51 77.47,16.51 80.64,13.34 80.64,10.04 SV4.5
N$10
  Top 0.305: R11.2 16.51,42.55 22.23,36.83 28.66,36.83 30.46,35.03 50.7,35.03 52.07,33.66 U1.3
N$12
  Top 0.305: R40.1 59.94,7.37 59.94,9.65 SV5.5 DIS1.5
  Bottom 0.305: SV3.26 24.13,50.42 44.07,30.48 47.5,30.48 48.26,29.72 48.26,26.04 60.07,14.22 60.07,9.91 DIS1.5
N$13
  Bottom 0.254: 51.8,7.63 51.19,8.24 51.19,10.92 51.18,10.92
  Bottom 0.305: U1.12 41.91,20.95 51.18,11.68 51.18,10.92 | DIS1.6 SV5.6 61.72,7.62 52.44,7.62 51.8,7.63
N$14  (via drill 0.6)
  Top 0.305: U1.21 29.21,28.45 30.48,27.18 30.48,23.5 33.4,20.57 R45.2
  Top 0.406: R39.2 40.64,3.94 v40.64,3.81
  Bottom 0.305: R45.2 34.29,13.97 40.64,7.62 v40.64,3.81
N$15
  Top 0.305: Q1.1 48.77,4.57 46.48,4.57 46.35,4.45 46.35,3.94 R39.1
N$16  (via drill 0.61)
  Top 0.305: v81.92,3.68 Q1.3
  Bottom 0.305: v81.92,3.68 SV4.8 DIS1.16
N$17  (1 unrouted)
  Top 0.61: R35.S 54.61,6.35 54.61,8.9 SV5.3
N$18
  Top 0.305: R26.2 22.86,52.58 26.67,56.39 SV3.24
N$19
  Top 0.305: R27.2 36.96,50.8 34.29,53.47 31.62,53.47 29.21,55.88 SV3.22
N$20
  Top 0.305: R28.2 52.07,52.07 44.45,52.07 43.81,52.7 38.1,52.7 35.56,55.24 33.27,55.24 32,56.64 31.75,56.64 SV3.20
N$21
  Top 0.305: R32.1 44.45,50.8 43.18,52.07 37.47,52.07 35.43,54.1 32.64,54.1 30.48,56.26 30.48,57.15 30.23,57.4 30.23,58.17 29.21,59.18 SV3.21
N$22
  Top 0.305: R31.1 30.48,52.58 27.69,55.37 27.69,56.01 27.94,56.26 27.94,57.15 27.69,57.4 27.69,58.29 26.67,59.31 SV3.23
N$23
  Top 0.305: R28.1 R25.1 58.67,38.1 60.83,40.26 77.6,40.26 81.53,44.2 82.33,44.2 82.54,44.11 92.95,44.11
  Top 0.61: 92.95,44.11 SW1.6
N$24
  Top 0.305: 87.84,42.02 86.48,43.38 81.86,43.38 78.11,39.62 61.38,39.62 58.67,36.85 45.38,36.85 44.14,38.1 R29.1 R27.1
  Top 0.61: SW1.5 87.84,42.02
N$25
  Top 0.305: 81.66,45.72 75.82,40.89 52.32,40.89 R15.1 46.35,38.1 46.16,38.16 46.1,38.1 R32.2
  Top 0.61: SW1.1 81.66,45.72
N$26
  Top 0.305: R31.2 R13.1 36.52,38.1 38.37,36.25 59.31,36.25 62.02,38.99 78.74,38.99 81.88,42.01 83.26,42.01 SW1.2
N$27
  Top 0.305: SW1.3 83.33,39.22 | 81.28,38.1 62.53,38.1 60.07,35.64 30.71,35.64 28.25,38.1 R12.1 R26.1
  Top 0.61: 83.33,39.22 81.28,38.1
N$28
  Top 0.61: LED1..K R23.2
N$29
  Top 0.61: LED2..K R22.2
N$30
  Top 0.305: 34.29,75.44 S1.4
  Top 0.61: 34.29,75.44 R24.1
N$31
  Top 0.61: R17.2 LED7..K
N$32
  Top 0.61: R3.1 SV2.8
N$33
  Top 0.61: SV2.7 R4.1
N$34
  Top 0.305: Q4.3 76.33,54.61 77.72,55.75 78.99,57.02 80.39,58.17 81.66,58.42 R48.2
N$35
  Top 0.61: LED3..K R21.2
N$36
  Top 0.61: LED4..K R20.2
N$37
  Top 0.61: SV2.6 R5.1
N$38
  Top 0.61: SV2.5 R6.1
N$39
  Top 0.61: SV2.4 R7.1
N$40
  Top 0.406: 56.52,92.08 58.42,92.08 58.42,90.81 | 58.42,90.81 58.42,89.53 | 58.42,89.53 59.05,88.9 | 56.52,90.81 58.42,90.81 | 56.52,89.53 58.42,89.53
N$41
  Top 0.305: Q3.3 80.77,50.8 81.66,51.69 81.66,53.34 R46.2
N$42
  Top 0.61: LED5..K R19.2
N$43
  Top 0.61: LED6..K R18.2
N$44
  Top 0.61: SV2.3 R8.1
N$45
  Top 0.61: SV2.2 R9.1
N$46
  Top 0.61: SV2.1 R10.1
N$47
  Top 0.406: 95.5,93.34 95.5,96.27
N$48
  Top 0.305: R43.2 Q2.3
N$49
  Top 0.406: 98.17,93.34 98.17,96.01
N$50
  Top 0.61: LED8..K R16.2
N$51
  Top 0.406: 17.78,6.1 16.38,8.26
N$52
  Top 0.61: R36.2 60.33,52.07 60.96,51.44 62.23,51.44 L1.1
N$55
  Top 0.305: R41.1 73.66,59.18 70.1,55.63 70.1,51.31 70.99,50.42 72.52,50.42 Q2.1
N$56
  Top 0.61: D1.5 R43.1
N$57
  Top 0.305: 83.44,54.23 83.44,53.34 R46.1 | 86.49,54.23 D1.6
  Top 0.61: 86.49,54.23 83.44,54.23
N$58
  Top 0.305: 83.44,57.53 83.44,58.42 R48.1 | 86.49,57.53 D1.4
  Top 0.61: 86.49,57.53 83.44,57.53
N$59
  Top 0.305: R42.2 64.77,46.99 64.77,55.88 R41.2 54.07,60.96 53.44,59.69 53.44,55.35 52.07,53.98 42.11,53.98 40.54,56.19 40.54,57.05 41.91,58.42 SV3.11
N$60
  Top 0.305: R47.1 79.76,61.47 73.79,55.5 72.64,55.5 Q4.1
N$61
  Top 0.305: R44.1 67.69,45.34 72.52,45.34 Q3.1
N$62  (via drill 0.35)
  Top 0.305: v35.43,68.71 34.8,68.71 14.73,87.25 USB_UART.4
  Bottom 0.305: SV3.4 52.07,55.24 50.8,53.98 42.95,53.98 40.74,56.19 40.74,60.86 37.47,64.14 35.56,64.14 34.29,65.41 34.29,67.06 v35.43,68.71
N$63  (via drill 0.35)
  Top 0.305: SV3.5 49.05,59.21 47.68,57.84 46.51,57.84 45.82,57.15 45.82,55.98 45.06,55.22 43.2,55.22 v43.18,55.24 | USB_UART.3 13.97,86.87 v35.43,66.8
  Bottom 0.305: USB_UART.3 6.35,96.14 | v43.18,55.24 43.18,60.33 37.47,66.04 v35.43,66.8
N$66
  Top 0.406: U1.23 26.04,29.21 24.77,27.94 23.5,27.94 22.86,27.3 22.86,24.77
  Top 0.61: SV1.2 14.1,13.34 14.1,23.37 | 14.1,23.37 16.51,23.37 | R30.2-2 11.3,25.65 14.1,23.37 | 22.86,24.77 22.86,23.5 16.51,23.37 | C6.2 16.51,23.37
N$67
  Top 0.406: 61.98,25.4 R45.1
  Top 0.61: S2.2 61.98,25.4
N$68
  Top 0.305: U1.24 26.67,16 24.13,12.7 19.21,10.81 17.14,10.79 SV1.3 | 7.62,5.08 R33.2-2
  Top 0.61: SV1.3 19.21,10.81 C7.2 | 7.62,5.08 8.89,5.08 11.43,7.62 11.43,8.89 13.34,10.79 17.14,10.79
N$69
  Top 0.406: C12.1 72.7,21.91 73.03,22.86 72.39,23.09 C13.1
  Top 0.61: SV7.2 76.2,26.67 73.03,22.86
N$70
  Top 0.406: C10.2 C11.2
  Top 0.61: 64.77,31.75 65.81,31.75 C10.2 | S2.3 64.77,31.75 | R42.1 64.77,31.75
N$71
  Top 0.305: R11.1 13.97,59.69 6.99,66.67 6.99,77.47 5.71,78.74
  Top 0.61: 5.71,78.74 IC1.11
N$72
  Top 0.305: 60.45,18.54 56.39,18.54 50.8,24.13 50.8,27.18 50.04,27.94 43.94,27.94 43.18,28.7 43.18,29.72 42.42,30.48 26.04,30.48 26.04,33.02 24.77,34.29 23.5,34.29 22.86,33.66 22.86,28.57 21.59,27.3 U1.28
  Top 0.406: C13.2 69.62,20.41 C12.2
  Top 0.61: C13.2 66.67,22.23 S2.1 60.45,18.54
N$73
  Top 0.305: USB_UART.1 1.27,94.61 R2.1 3.17,90.17 1.09,88.09 1.09,70.03 1.91,68.58
  Top 0.61: 1.91,68.58 IC1.15
N$74
  Top 0.305: SV3.3 52.07,64.14 52.07,64.77 JP7.1
  Top 0.406: R34.1 60.96,63.5 R36.1 55.88,64.14 | 55.88,64.14 52.07,64.14 | 55.88,64.14 C8.2
N$75
  Top 0.305: JP10.1 U1.9
N$76
  Top 0.305: JP10.2 U1.7
N$77
  Top 0.305: JP10.3 U1.5
N$78
  Top 0.305: JP3.3 U1.10
N$79
  Top 0.305: JP3.2 U1.8
N$80
  Top 0.305: JP3.1 U1.6
N$81
  Top 0.305: U1.26 JP4.1
N$82
  Top 0.305: JP5.1 U1.22
N$83
  Top 0.305: U1.25 JP8.1
P0.8
  Top 0.305: 92.46,66.04 92.46,65.79 R47.2 | R23.1 92.46,66.04 | 92.46,66.04 88.56,66.04 87.78,65.25 87.38,64.9 75.95,64.9 74.78,63.98 72.24,63.98 69.06,60.17 69.06,57.96 67.77,56.67 66.52,56.67 65.41,57.78 65.41,64.46 65.28,64.52 65.02,64.77 62.23,64.77 61.47,65.53 58.93,65.53 57.02,67.44 50.16,67.44 49.4,66.67 49.4,66.55 43.08,59.59 43.08,58.73 41.91,57.56 SV3.12
  Top 0.406: R10.2 92.71,66.04 92.46,65.79
  Bottom 0.305: 41.91,56.64 SV3.12
P0.9  (via drill 0.6)
  Top 0.406: SV3.13 39.37,59.69 48.82,69.09 48.77,69.22 48.9,69.34 57.15,69.34 59.44,67.06 61.98,67.06 62.48,66.55 v66.67,66.55 66.7,66.57 | R44.2 67.31,62.23 69.72,64.64 74.17,64.64 75.95,65.91 86.23,65.91 R22.1 91.44,71.12 91.44,88.9 90.17,90.17 R9.2
  Bottom 0.406: R44.2 67.31,64.52 v66.67,66.55
P0.10
  Top 0.305: SV3.14 39.37,57.78 39.63,58.04 39.85,58.04 40.54,58.73 40.54,59.59 40.64,59.69
  Top 0.406: 40.64,59.69 49.25,68.2 49.4,68.33 57.15,68.33 59.18,66.29 61.72,66.29 62.48,65.53 65.15,65.53 65.28,65.41 67.94,65.41 68.2,65.53 70.1,66.8 79.12,66.8 R21.1 87,76.45 87,87.88 87.63,88.52 R8.2
P0.11
  Top 0.406: SV3.15 36.83,59.69 48.16,71.02 48.26,70.99 58.04,70.99 59.44,69.6 64.64,69.6 65.15,69.85 74.93,69.85 76.12,70.94 R20.1 85.47,78.87 85.47,88.39 85.09,88.77 R7.2
P0.12  (via drill 0.6)
  Top 0.406: SV3.16 38.15,57.99 38.15,59.72 47.02,68.58 48.39,69.85 48.64,70.1 57.91,70.1 59.44,68.58 R19.1 69.98,68.71 | R6.2 82.55,92.08 82.68,92.08 82.68,88.52 82.8,88.39 83.44,88.39 84.2,87.5 84.2,80.01 76.45,72.9 76.07,72.9 74.42,71.5 v71.5,71.5
  Bottom 0.406: v71.5,71.5 71.5,70.23 R19.1
P0.13
  Top 0.406: SV3.17 47.11,71.78 47.15,71.78 47.36,71.86 63.5,71.86 | 63.5,71.86 63.37,71.73 | 63.37,71.73 63.4,71.22 | 63.37,71.73 63.37,71.88 65.02,73.15 74.68,73.15 80.9,78.36 80.77,88.9 80.01,89.66 R5.2 | R18.1 63.5,71.86
P0.14
  Top 0.305: 46.23,77.34 R14.1 39.37,77.47 S1.2 | IC1.3 11.94,71.25 | 39.24,77.47 S1.2 | 32.13,58.04 33.53,56.64 34.29,56.64 SV3.18 | 32.13,58.04 31.24,58.04 30.48,58.8 30.48,60.71 | S1.2 39.32,68.91 33.4,62.74 32,62.23 30.48,60.71 | 13.46,71.12 13.72,71.12 14.48,70.36 14.61,63.88 20.7,58.04 21.97,58.04 22.23,57.78 23.5,57.78 23.75,58.04 24.64,58.04 25.4,58.8 25.4,59.69 26.42,60.71 30.48,60.71 | R17.1 57.02,73.41 56.13,72.52 45.85,72.52 33.02,59.69 33.02,58.8 32.26,58.04 32.13,58.04
  Top 0.406: R17.1 59.44,74.42 74.3,74.42 79.5,78.87 79.5,87.63 77.47,89.66 R4.2
  Top 0.61: 13.46,71.12 IC1.3
P0.21  (via drill 0.6)
  Top 0.406: SV3.25 24.13,59.56 22.99,60.71 20.07,60.71 17.27,63.5 17.27,66.55 17.4,66.67 17.14,66.67 16.38,67.44 16.38,81.28 v16.64,82.17
  Bottom 0.406: v16.64,82.17 16.64,85.72 16.38,85.98 16.38,96.39 JP6.1
P0.23  (via drill 0.6)
  Top 0.406: v15.62,83.31 15.62,66.93 16.51,66.04 16.51,63.25 20.57,59.18 21.59,59.18 SV3.27
  Bottom 0.406: v15.62,83.31 15.62,94.74 13.97,96.39 JP6.2
P1.23  (1 unrouted)
  Top 0.254: 79.12,13.34 79.12,10.56 79.12,10.31 79.12,8.24 79.38,7.99 79.63,7.75
  Top 0.305: DIS1.14 82.94,9.28 81.92,7.75 79.63,7.75 | U1.14 39.93,26.11 39.93,25.88 42.43,23.38 42.43,20.89 43.69,19.63 52.53,19.63 56.26,15.9 57.12,15.9 57.15,15.88 76.83,15.88 79.12,13.34
P1.24  (1 unrouted)
  Bottom 0.305: U1.11 41.91,28.45 43.18,27.18 43.18,20.95 52.32,11.81 56.26,11.81 57.53,9.91 SV5.4
SCL  (via drill 0.6)
  Top 0.305: SV9.3 SV8.3 SV6.3 | I2C.3 46.99,93.98
  Top 0.406: R38.2 46.99,93.98 48.9,92.08 IC2.2 52.7,92.08 53.34,92.71 53.34,95.89 55.24,97.79 v59.05,97.79
  Bottom 0.305: SV3.6 49.53,57.53 48.26,58.8 48.26,65.91 47.62,66.55 47.62,95.89 I2C.3
  Bottom 0.406: v59.05,97.79 60.33,99.06 62.87,99.06 64.77,97.16 SV6.3
SDA
  Top 0.305: SV9.4 SV8.4 SV6.4 62.1,96.52 | R37.2 44.58,93.47 44.2,93.47 44.2,96.27 I2C.2 44.45,96.9
  Top 0.406: IC2.1 51.44,93.34 51.44,97.79 | 51.44,97.79 50.16,99.06 46.35,99.06 45.09,97.79 45.09,97.16 I2C.2 | 51.44,97.79 52.7,99.06 59.69,99.06 SV6.4
  Bottom 0.305: SV3.7 46.99,93.98 I2C.2
SPI_MISO
  Bottom 0.305: SV3.9 44.45,74.3 30.48,87 30.48,90.17 SPI.5
SPI_MOSI
  Bottom 0.305: SV3.10 44.45,57.53 45.72,58.8 45.72,74.55 31.75,87.25 SPI.2
SPI_SCK  (via drill 0.61)
  Top 0.305: v48.64,83.57 40.26,92.58 36.32,92.58 35.56,93.34 31.75,93.34 30.61,93.85 SPI.3
  Bottom 0.305: v48.64,83.57 48.64,66.42 50.8,64.26 50.8,56.26 50.04,55.5 49.02,55.5 47.88,56.64 46.99,56.64 SV3.8
SPI_SEL
  Top 0.305: SV3.19 31.75,59.82 32.64,60.71 33.02,60.96 45.48,73.66 50.83,73.66 49.28,73.71 R16.1 | SPI.4 26.67,93.98 31.11,89.53 31.11,87.63 38.73,80.01
  Top 0.406: R16.1 50.83,73.66 53.85,73.66 55.88,75.69 74.17,75.69 77.98,78.99 77.98,87.25 74.93,90.3 R3.2 | 38.73,80.01 46.23,80.01 49.02,77.22 49.02,73.79 49.28,73.71

### Text on the board
tPlace: P0.26/P0.27: / USB device interface | P1.26-P1.31: / JTAG
tNames: GD | 3.3V | SDA | SCL | GND | SDA | SCL | 3.3V | P0.15 0.14 0.13 0.12 0.11 0.10 0.9 0.8 | RTS | TXD | RXD | GND | P0.23 | P0.21 | 3.3V | DTR | GND | SPI MOSI / (P0.6) | 0.15 / 0.14 / 0.13 / 0.12 / 0.11 / 0.10 / 0.9 / 0.8 | SPI MISO (P0.5) | SPI SCK (P0.4) | SPI SEL LEDS (P0.15) | P0.21/PWM5/AIN14/CAP1.3 | ISO-SDA (P0.3) | ISO-SCL (P0.2) | Vref | B / R / G | P0.8 / P0.7 / P0.9 | P0.26/AIN5 | pwm2 p0.7 | Ain1 | Ain#3 / p0.30 | +5V / in / gnd / gnd | P0.31(USB) | Aout p0.25 | P0.27/AIN0/CAP0.1/MAT0.1 | P0.28/AIN1/CAP0.2/MAT0.2 | P0.29/AIN2/CAP0.3/MAT0.3 | P1.24 / P0.22 / P1.25 / P1.16 / P1.17 / P1.18 / P1.19 / P1.20 / P1.21 / P1.22 / P1.23 | Ain2 | GND / VCC / VLCD / RS / R/W / E / D0 / D1 / D2 / D3 / D4 / D5 / D6 / D7 / LED_A / LED_C
bNames: P0.23 / P0.21 / P0.19 / P0.17 / P0.15 / P0.13 / P0.11 / P0.9 / P0.7 / P0.5 / P0.3 / P0.1 / VREF / VBAT | GND / P0.22 / P0.20 / P0.18 / P0.16 / P0.14 / P0.12 / P0.10 / P0.8 / P0.6 / P0.4 / P0.2 / P0.0 / 3V3 | GND / P0.26 / P0.28 / P0.30 / P1.16 / P1.18 / P1.20 / P1.22 / P1.24 / P1.26 / P1.28 / P1.30 / RST / VB | P0.25 / P0.27 / P0.29 / P0.31 / P1.17 / P1.19 / P1.21 / P1.23 / P1.25 / P1.27 / P1.29 / P1.31 / 3V3 / 5V
tValues: P0.17 Up / P0.19 L / P0.20 Dow | P0.16 Ce / P0.18 R / GND